# EasyEDA Pro project Příloha E.epro

# Schematic dps
Board Name: Převodník v1_1; Create Date: 2024-11-07; Page Name: Převodník; Project Name: PRO_MAT_IBIS; Schematic Name: MAT_IBIS_1; Update Date: 2024-11-07; Add into BOM: yes; Company: Your Company; Convert to PCB: yes; Date: 2024-06-18; Draw By: Diskoteka STAR; REV: 1.0; Sheet: 1/1
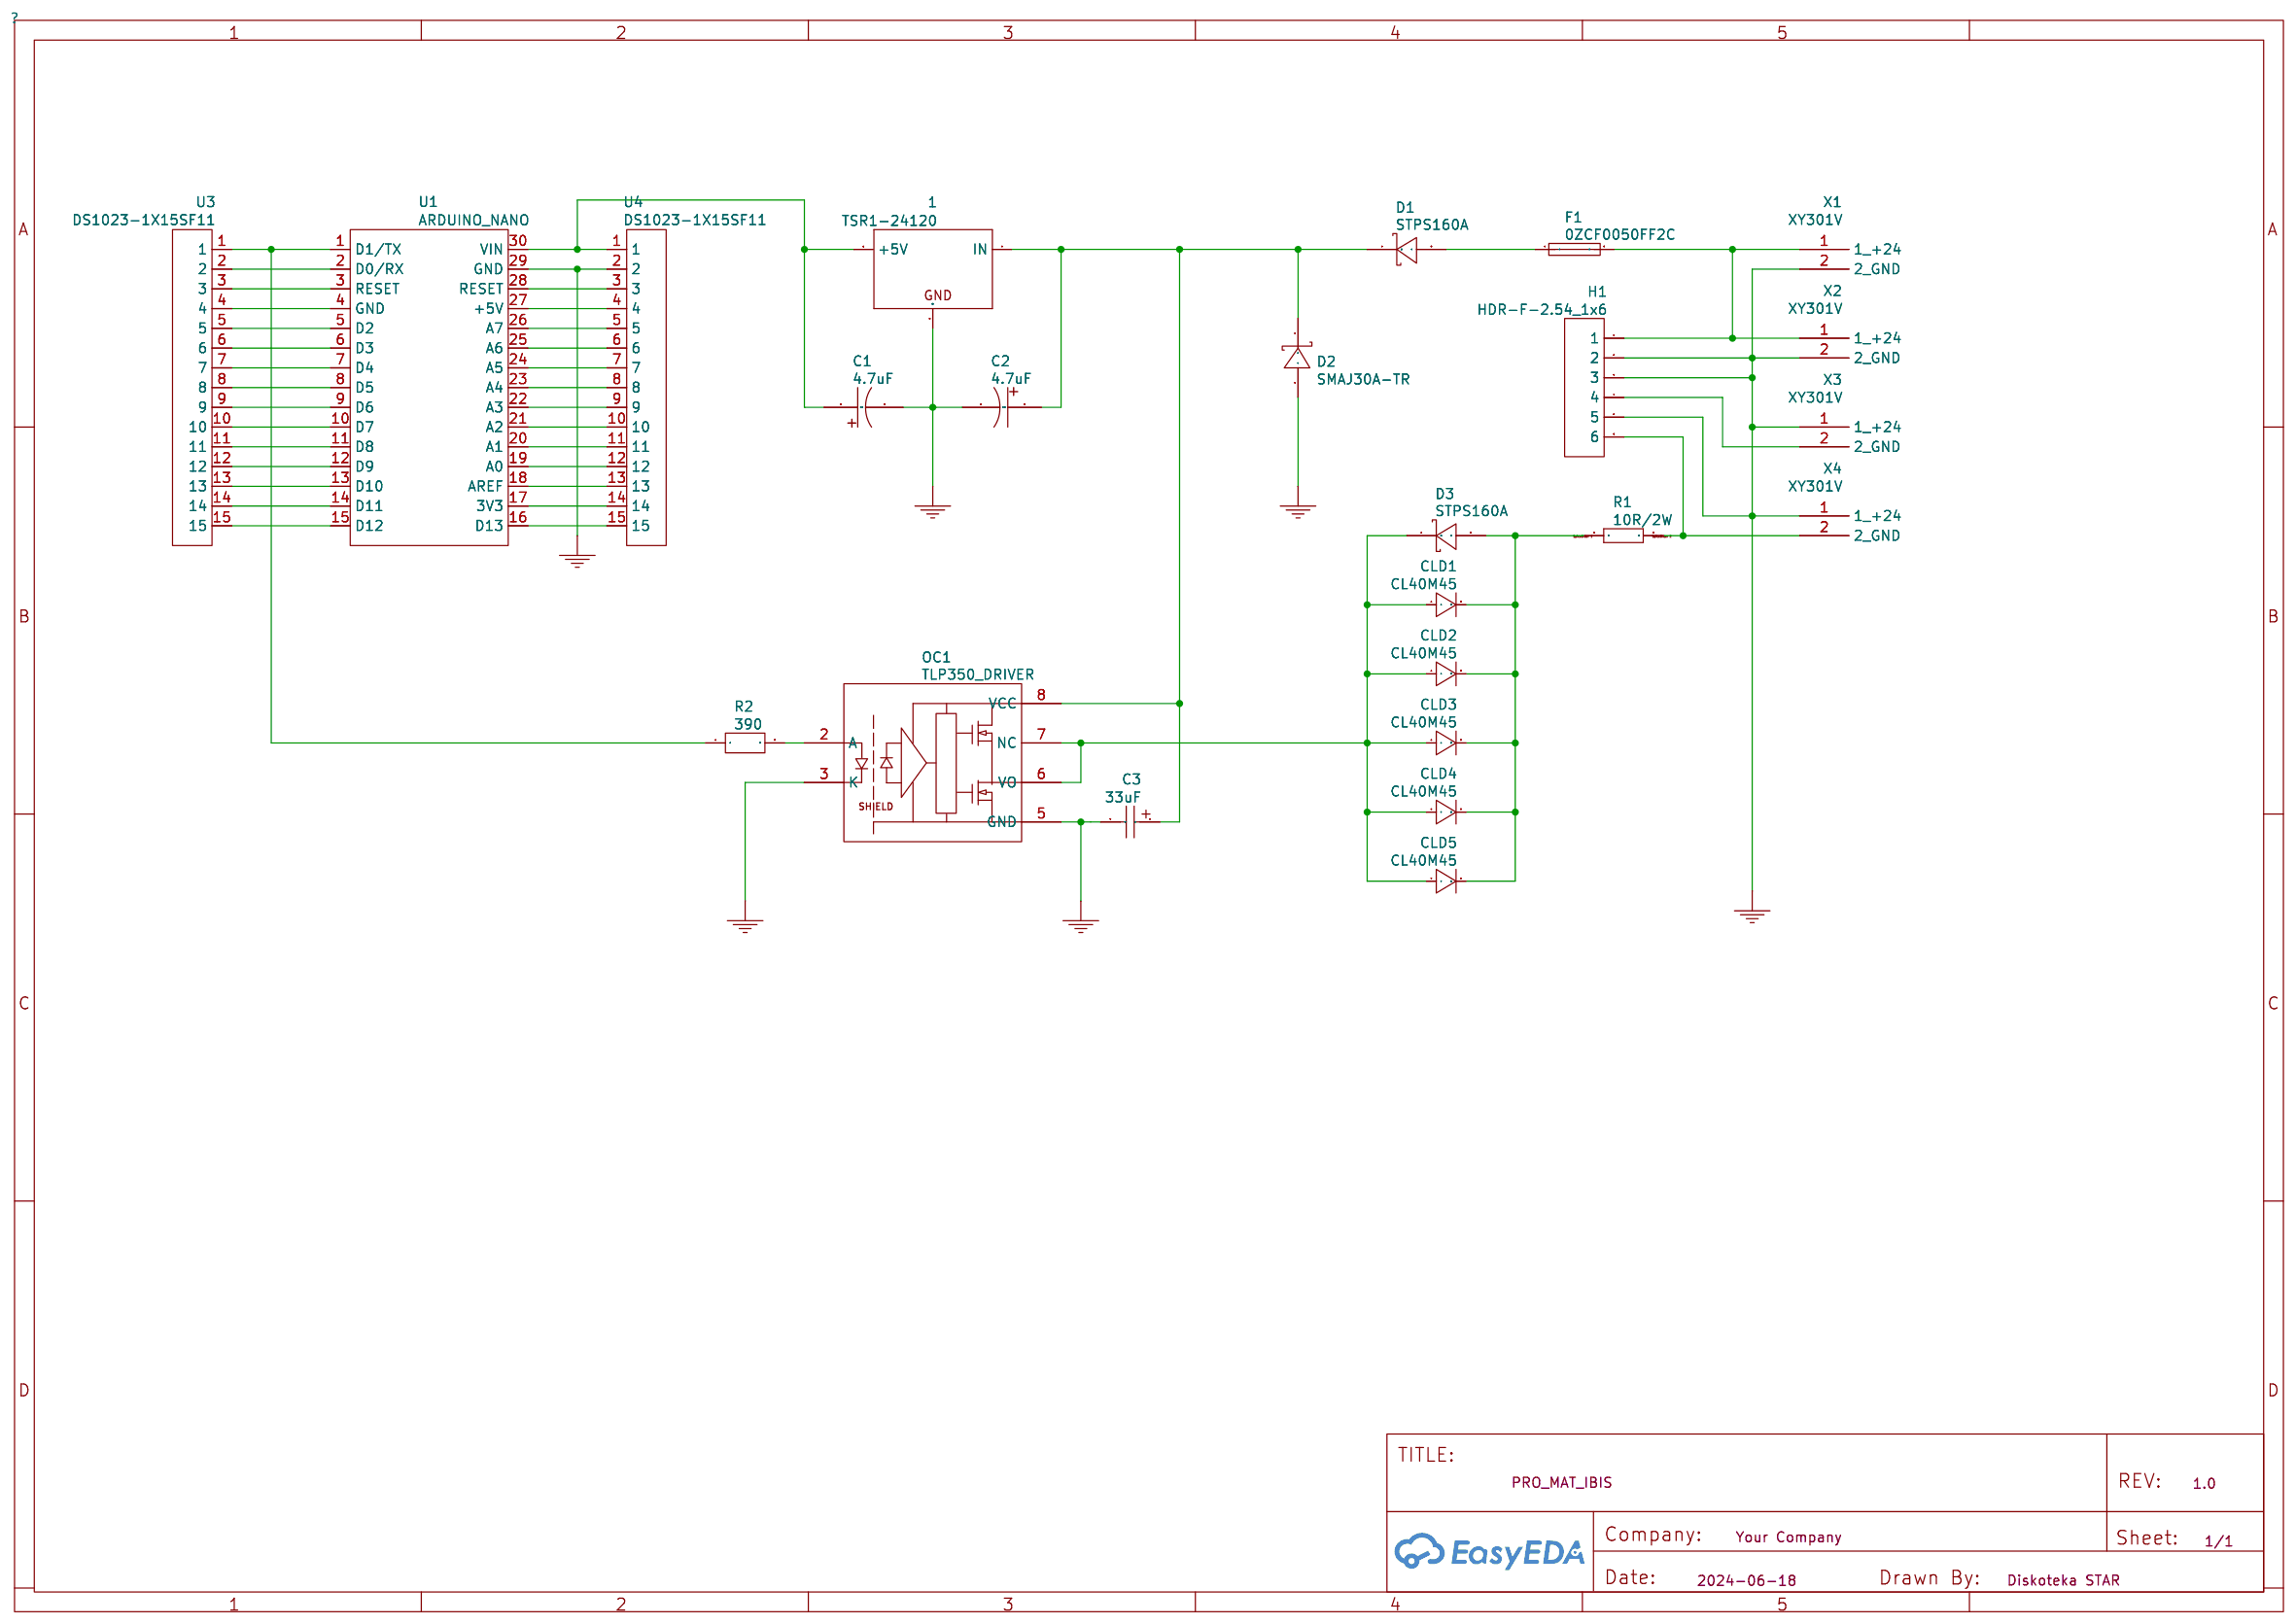
[diagram p0: schematic sheet]

## Parts
1  TSR1-24120
C1  4.7uF
C2  4.7uF
C3  33uF
CLD1  CL40M45
CLD2  CL40M45
CLD3  CL40M45
CLD4  CL40M45
CLD5  CL40M45
D1  STPS160A
D2  SMAJ30A-TR
D3  STPS160A
F1  0ZCF0050FF2C
H1  HDR-F-2.54_1x6
OC1  TLP350_DRIVER
R1  10R/2W
R2  390
U1  ARDUINO_NANO
U3  DS1023-1X15SF11
U4  DS1023-1X15SF11
X1  XY301V
X2  XY301V
X3  XY301V
X4  XY301V

## Library data of the parts
1 = TSR1-24120: Supplier: Mouser
C1 C2 = 4.7uF: Supplier: LCSC; Supplier Part: C3020635; Manufacturer: VISHAY(威世); Manufacturer Part: 293D475X9035B2TE3; JLCPCB Part Class: Extended Part
C3 = 33uF: Supplier: LCSC; Manufacturer: Kyocera AVX; Manufacturer Part: TPSD336K035R0300; Supplier Part: C8029; JLCPCB Part Class: Extended Part
CLD1-CLD5 = CL40M45: Supplier: TME; Manufacturer: DIO; Manufacturer Part: LL4148-GS08; Supplier Part: LL4148-GS08
D1 D3 = STPS160A: Supplier Part: C165938; Supplier: LCSC; Manufacturer: ST(意法半导体); JLCPCB Part Class: Extended Part
D2 = SMAJ30A-TR: Supplier: LCSC; Manufacturer: ST(意法半导体); Supplier Part: C132943; JLCPCB Part Class: Extended Part
F1 = 0ZCF0050FF2C: Supplier: Mouser; Manufacturer: Bel Fuse; Manufacturer Part: 530-0ZCF0050FF2C; Hold Current: 500 mA; Maximum Voltage: 60 VDC
H1 = HDR-F-2.54_1x6: Supplier Part: C40877; Supplier: LCSC
OC1 = TLP350_DRIVER: Supplier: LCSC; Manufacturer: TOSHIBA(东芝); Manufacturer Part: TLP350(F); Supplier Part: C50232; JLCPCB Part Class: Extended Part
R1 = 10R/2W
R2 = 390
U1 = ARDUINO_NANO: Supplier: LCSC; Supplier Part: C9900017879; Manufacturer: null; JLCPCB Part Class: Extended Part
U3 U4 = DS1023-1X15SF11: Supplier: LCSC; Supplier Part: C7509525; Manufacturer: CONNFLY; Manufacturer Part: DS1023-1x15SF11; JLCPCB Part Class: Extended Part
X1-X4 = XY301V: Supplier: LCSC; Supplier Part: C557651; Manufacturer: XINLAIYA(新莱亚); Manufacturer Part: XY301V-A-5.0-2P; JLCPCB Part Class: Extended Part

## Nets
GND: 1.2(GND) C1.2 C2.2 C3.2 D2.2(A) H1.2 H1.3 H1.5 OC1.3(K) OC1.5(GND) U1.29(GND) U4.2 X1.2(2 GND) X2.2(4 GND) X3.1(5 ME) X4.1(7 MS)
D1_2: D1.2(A) F1.1
D3_1: CLD1.1(A) CLD2.1(A) CLD3.1(A) CLD4.1(A) CLD5.1(A) D3.1(C) OC1.6(VO) OC1.7(NC)
D3_2: CLD1.2(C) CLD2.2(C) CLD3.2(C) CLD4.2(C) CLD5.2(C) D3.2(A) R1.1
F1_2: F1.2 H1.1 X1.1(1 +24) X2.1(3 +24)
Net-(1-1): 1.1(IN) C2.1 C3.1 D1.1(C) D2.1(K) OC1.8(VCC)
Net-(1-3): 1.3(+5V) C1.1 U1.30(VIN) U4.1
OC1_2: OC1.2(A) R2.2
R1_2: H1.6 R1.2 X4.2(8 SD)
U1_1: R2.1 U1.1(D1/TX) U3.1
U1_2: U1.2(D0/RX) U3.2
U1_3: U1.3(RESET) U3.3
U1_4: U1.4(GND) U3.4
U1_5: U1.5(D2) U3.5
U1_6: U1.6(D3) U3.6
U1_7: U1.7(D4) U3.7
U1_8: U1.8(D5) U3.8
U1_9: U1.9(D6) U3.9
U1_10: U1.10(D7) U3.10
U1_11: U1.11(D8) U3.11
U1_12: U1.12(D9) U3.12
U1_13: U1.13(D10) U3.13
U1_14: U1.14(D11) U3.14
U1_15: U1.15(D12) U3.15
U1_16: U1.16(D13) U4.15
U1_17: U1.17(3V3) U4.14
U1_18: U1.18(AREF) U4.13
U1_19: U1.19(A0) U4.12
U1_20: U1.20(A1) U4.11
U1_21: U1.21(A2) U4.10
U1_22: U1.22(A3) U4.9
U1_23: U1.23(A4) U4.8
U1_24: U1.24(A5) U4.7
U1_25: U1.25(A6) U4.6
U1_26: U1.26(A7) U4.5
U1_27: U1.27(+5V) U4.4
U1_28: U1.28(RESET) U4.3
X3_2: H1.4 X3.2(6 ED)

# Board dps
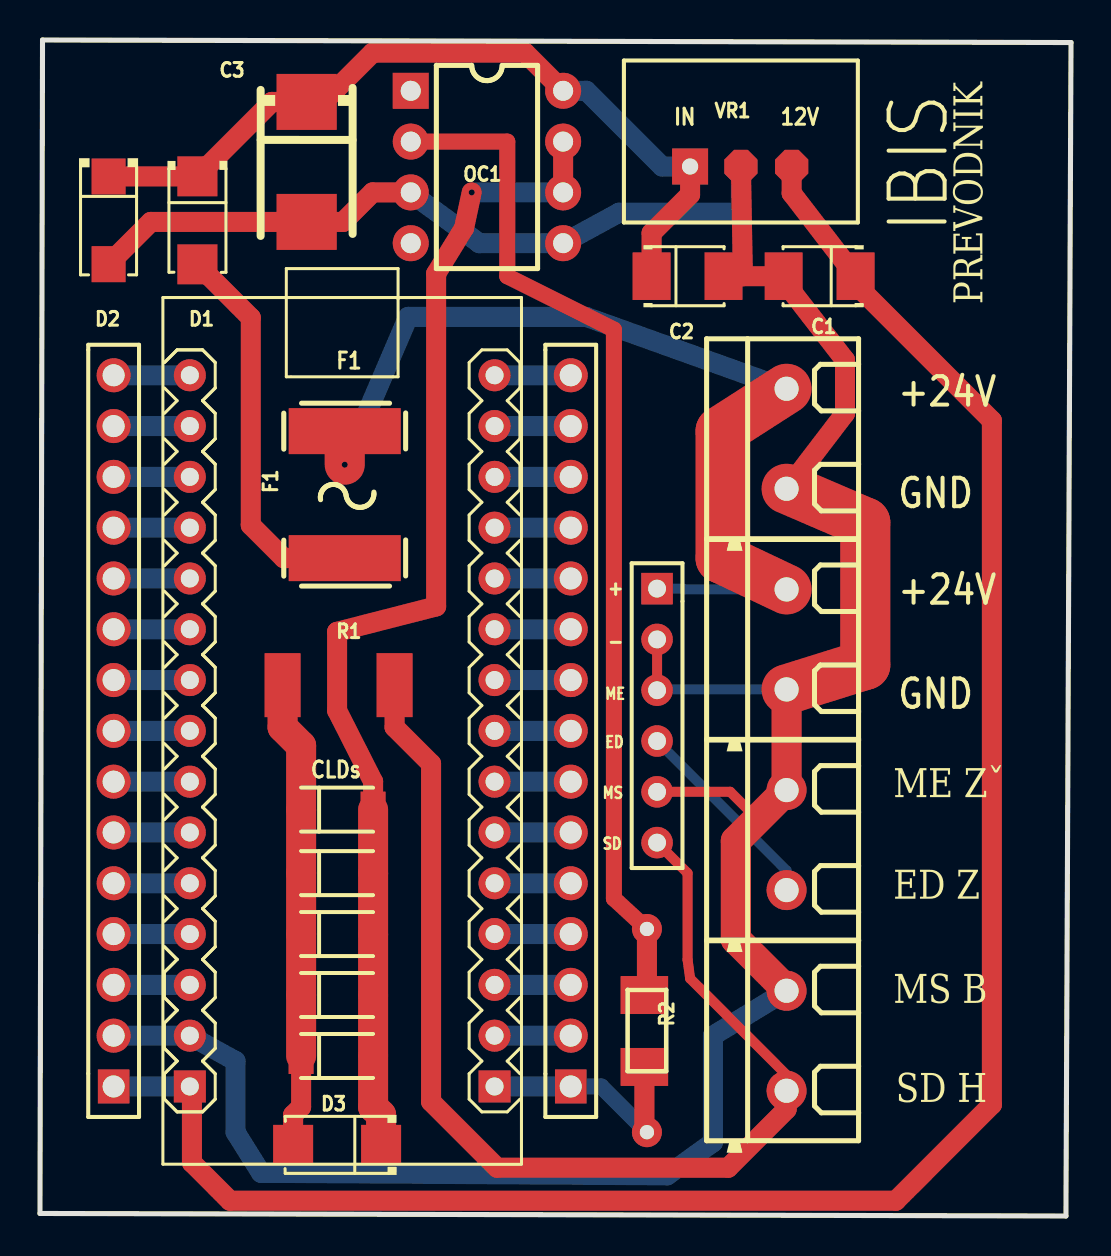
[diagram p1: board, top side]
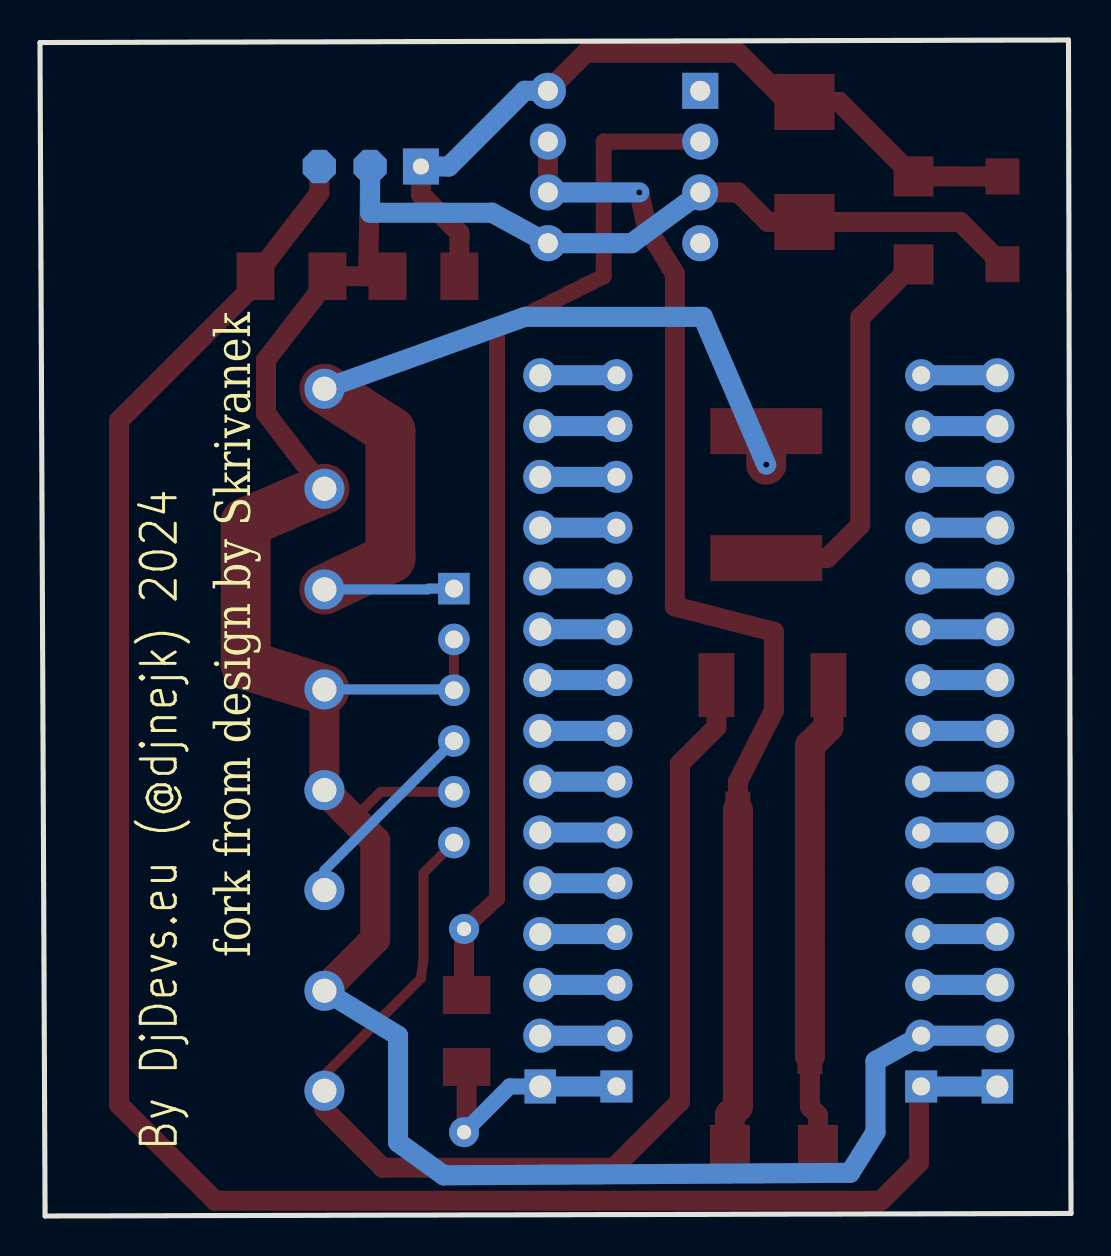
[diagram p2: board, bottom side, seen from below]

Outline 51.56 x 58.8 mm; copper layers: Top Layer, Bottom Layer. Coordinates in mm from the lower left corner of the outline.
Outline path: 0,0.13 0.13,58.8 51.56,58.67 51.31,0 0,0.13
Stack: Top Layer 0.035mm / Dielectric1 1.51mm FR4 er 4.5 / Bottom Layer 0.035mm

## Design rules (mm)
spacing Default (default): track to track 0.152, other pairs 0 to 0.152
track width Default (default): min 0.5, default 0.5, max 25.4
differential pair differentialPair (default): width min 0.127, default 0.254, max 2.54; gap min 0.152, default 0.152
via Default (default): diameter min 0.61, default 0.61, max 100.025; hole min 0.305, default 0.305, max 59.995

## Placement (name value [footprint] x y rotation side)
C1  4.7uF  [CAP-SMD_L3.5-W2.8-FD]  38.99 46.99 180 top
C2  4.7uF  [CAP-SMD_L3.5-W2.8-FD]  32.38 46.99 0 top
C3  33uF  [CASE-D_7343]  13.34 52.7 90 top
CLD1  CL40M45  [LL-34]  14.86 20.32 0 top
CLD2  CL40M45  [LL-34]  14.86 17.14 0 top
CLD3  CL40M45  [LL-34]  14.86 14.1 0 top
CLD4  CL40M45  [LL-34]  14.86 11.05 0 top
CLD5  CL40M45  [LL-34]  14.86 8 0 top
D1  STPS160A  [SMA_L4.3-W2.6-LS5.2-RD]  7.87 49.78 270 top
D2  SMAJ30A-TR  [SMA_L4.4-W2.6-LS5.0-RD]  3.43 49.78 270 top
D3  STPS160A  [SMA_L4.3-W2.6-LS5.2-RD]  14.86 3.56 180 top
F1  0ZCF0050FF2C  [F2920]  15.24 36.07 90 top
H1  HDR-F-2.54_1x6  [HDR-F-2.54_1X6]  30.86 26.29 270 top
NOREF  -  [Pad_e124]  30.23 11.05 90 top
NOREF#2  -  [Pad_e123]  30.23 7.45 90 top
OC1  TLP350_DRIVER  [DIP-8_L9.7-W6.4-P2.54-LS7.6-BL-1]  22.35 52.45 270 top
R1  10R/2W  [R2512]  14.73 26.54 0 top
R2  390  [REZISTOR]  30.23 9.4 270 top
U1  ARDUINO_NANO  [COMM-TH_ARDUINO_NANO]  15.11 24.26 270 top
U3  DS1023-1X15SF11  [HDR-TH_15P-P2.54-V-F]  26.54 24.26 90 top
U4  DS1023-1X15SF11  [HDR-TH_15P-P2.54-V-F]  3.68 24.26 90 top
VR1  TSR1-24120  [TSR-1]  35.05 53.97 0 top
X1  XY301V  [CONN-TH_XY301V-A-5.0-2P]  37.34 38.86 270 top
X2  XY301V  [CONN-TH_XY301V-A-5.0-2P]  37.34 28.83 270 top
X3  XY301V  [CONN-TH_XY301V-A-5.0-2P]  37.34 18.8 270 top
X4  XY301V  [CONN-TH_XY301V-A-5.0-2P]  37.34 8.76 270 top

## Footprints (pads in the part's own frame, mm; a bottom-side part is the same pattern mirrored in y, then rotated)
CAP-SMD_L3.5-W2.8-FD
  rect 1.9x2.376 smd: 1(-1.798,0) 2(1.798,0)
CASE-D_7343
  rect 2.799x3.01 smd: 1(3,0) 2(-3,0)
COMM-TH_ARDUINO_NANO
  rect 1.6x1.6 hole 0.9: 1(17.78,7.62) 30(17.78,-7.62)
  round 1.6 hole 0.9: 2(15.24,7.62) 3(12.7,7.62) 4(10.16,7.62) 5(7.62,7.62) 6(5.08,7.62) 7(2.54,7.62) 8(0,7.62) 9(-2.54,7.62) 10(-5.08,7.62) 11(-7.62,7.62) 12(-10.16,7.62) 13(-12.7,7.62) 14(-15.24,7.62) 15(-17.78,7.62) 16(-17.78,-7.62) 17(-15.24,-7.62) 18(-12.7,-7.62) 19(-10.16,-7.62) 20(-7.62,-7.62) 21(-5.08,-7.62) 22(-2.54,-7.62) 23(0,-7.62) 24(2.54,-7.62) 25(5.08,-7.62) 26(7.62,-7.62) 27(10.16,-7.62) 28(12.7,-7.62) 29(15.24,-7.62)
CONN-TH_XY301V-A-5.0-2P
  round 2 hole 1.205x1.2: 1(-2.5,0) 2(2.5,0)
DIP-8_L9.7-W6.4-P2.54-LS7.6-BL-1
  rect 1.8x1.8 hole 1: 1(-3.81,-3.81)
  round 1.8 hole 1: 2(-1.27,-3.81) 3(1.27,-3.81) 4(3.81,-3.81) 5(3.81,3.81) 6(1.27,3.81) 7(-1.27,3.81) 8(-3.81,3.81)
F2920
  rect 2.3x5.6 smd: 1(-3.175,0) 2(3.175,0)
HDR-F-2.54_1X6
  rect 1.575x1.575 hole 0.889: 1(-5.08,0)
  round 1.575 hole 0.889: 2(-2.54,0) 3(0,0) 4(2.54,0) 5(5.08,0) 6(7.62,0)
HDR-TH_15P-P2.54-V-F
  rect 1.7x1.575 hole 1.1: 1(-17.78,0)
  round 1.7 hole 1.1: 2(-15.24,0) 3(-12.7,0) 4(-10.16,0) 5(-7.62,0) 6(-5.08,0) 7(-2.54,0) 8(0,0) 9(2.54,0) 10(5.08,0) 11(7.62,0) 12(10.16,0) 13(12.7,0) 14(15.24,0) 15(17.78,0)
LL-34
  rect 1.25x1.8 smd: 1(1.8,0) 2(-1.8,0)
Pad_e123
  rect 1.9x2.376 smd: 1(0,0)
Pad_e124
  rect 1.9x2.376 smd: 2(0,0)
R2512
  rect 1.8x3.2 smd: 1(-2.6,0) 2(3,0)
REZISTOR
  round 1.5 hole 0.711: 1(5.207,0.128) 2(-4.954,0.128)
SMA_L4.3-W2.6-LS5.2-RD
  rect 2x2 smd: 1(-2.2,0) 2(2.2,0)
SMA_L4.4-W2.6-LS5.0-RD
  rect 1.8x1.7 smd: 1(-2.192,0) 2(2.192,0)
TSR-1
  rect 1.8x1.8 hole 0.805x0.8: 1(-2.54,-1.5)
  custom 1.663x1.663 hole 0.805x0.8: 2(0,-1.5) 3(2.54,-1.5)

## Nets
As in the schematic, except:
GND: C1.2 C2.2 C3.2 D2.2 H1.2 H1.3 H1.5 OC1.3 OC1.5 U1.29 U4.2 VR1.2 X1.2 X2.2 X3.1 X4.1
1_1: C2.1 C3.1 D1.1 D2.1 OC1.8 VR1.1
OC1_2: NOREF.2 OC1.2 R2.2
U1_1: NOREF#2.1 R2.1 U1.1 U3.1
U1_30: C1.1 U1.30 U4.1 VR1.3

Pads without a net: OC1 1 4

## Via types
v1: diameter 0.61, hole 0.305, Top Layer to Bottom Layer, 2 vias

## Routing (per net, layer and track width the routed paths; a pad name or vN(x,y) marks a point on that pad's centre or on a via; arc(x,y) is an arc through that point)
GND: length 154.8
  Top Layer w0.5: X3.1 35.89,19.84 34.52,21.21 H1.5 ; H1.2 H1.3 ; VR1.2 35.05,51.14 ; C1.2 37.23,46.99
  Top Layer w1: 35.05,52.58 35.15,46.99 34.18,47.09 ; OC1.3 16.64,51.18 15.16,49.7 C3.2 5.54,49.7 D2.2 ; X1.2 37.38,36.36 40.26,40.13 40.26,42.8 37.19,46.76 C1.2 C2.2
  Top Layer w1.5: X2.2 X3.1 34.8,18.76 34.8,13.84 37.34,11.3 X4.1
  Top Layer w2.5: X1.2 41.28,34.67 41.28,27.56 X2.2
  Bottom Layer w0.5: H1.3 30.9,26.33 X2.2
  Bottom Layer w1: U4.2 U1.29 9.78,7.75 9.78,4.19 11.05,2.16 31.37,2.03 33.66,3.68 33.66,9.02 X4.1 ; OC1.3 18.54,51.15 21.97,48.64 OC1.5 28.96,50.17 35.05,50.17 VR1.2
1_1: length 40.3
  Top Layer w1: D1.1 11.59,55.7 C3.1 14.18,55.7 16.64,58.17 24.26,58.17 OC1.8 ; C2.1 30.59,49.15 32.51,51.07 VR1.1 ; D2.1 7.87,51.98
  Bottom Layer w1: OC1.8 27.33,56.26 31.11,52.47 VR1.1
D1_2: length 22.8
  Top Layer w0.5: F1.1 11.94,32.89
  Top Layer w1: F1.1 12.19,32.89 10.54,34.54 10.54,44.92 D1.2
D3_1: length 59.6
  Top Layer w1: OC1.6 OC1.7 ; 16.66,21.72 14.86,25.27 14.86,29.21 19.81,30.48 19.81,47.12 21.21,49.4 v1(21.59,51.18) ; CLD1.1 16.66,21.72
  Top Layer w1.5: D3.1 17.06,5.06 16.66,5.46 CLD5.1 CLD4.1 CLD3.1 CLD2.1 CLD1.1
  Bottom Layer w1: OC1.6 v1(21.59,51.18)
D3_2: length 23.5
  Top Layer w1: D3.2 12.66,5.06 13.06,5.46 CLD5.2
  Top Layer w1.5: CLD5.2 CLD4.2 CLD3.2 CLD2.2 CLD1.2 13.06,23.52 12.13,24.44 R1.1
F1_2: length 49.7
  Top Layer w2: F1.2 v1(15.24,37.57)
  Top Layer w2.5: X1.1 34.04,39.24 34.04,32.89 X2.1
  Bottom Layer w0.5: X2.1 32.19,31.33 32.15,31.37 H1.1
  Bottom Layer w1: 15.24,37.57 18.41,44.96 27.31,44.96 X1.1
OC1_2: length 51.6
  Top Layer w0.8: OC1.2 23.37,53.72 23.37,46.99 28.7,44.32 28.7,15.88 R2.2
  Top Layer w1: NOREF.2 30.35,11.18 R2.2
R1_2: length 57.9
  Top Layer w0.5: H1.6 32.38,17.14 32.38,12.83 32.51,11.87 37.34,7.05 X4.2
  Top Layer w1: 17.73,24.44 19.56,22.62 19.56,5.72 22.86,2.41 34.42,2.41 37.34,5.33 X4.2 ; R1.2 17.73,24.44
U1_1: length 11.9
  Top Layer w1: R2.1 30.23,4.32 NOREF#2.1
  Bottom Layer w0.8: R2.1 28.07,6.48 U3.1
  Bottom Layer w1: U1.1 U3.1
U1_2: length 3.8
  Bottom Layer w1: U3.2 U1.2
U1_3: length 3.8
  Bottom Layer w1: U3.3 U1.3
U1_4: length 3.8
  Bottom Layer w1: U3.4 U1.4
U1_5: length 3.8
  Bottom Layer w1: U3.5 U1.5
U1_6: length 3.8
  Bottom Layer w1: U3.6 U1.6
U1_7: length 3.8
  Bottom Layer w1: U3.7 U1.7
U1_8: length 3.8
  Bottom Layer w1: U3.8 U1.8
U1_9: length 3.8
  Bottom Layer w1: U3.9 U1.9
U1_10: length 3.8
  Bottom Layer w1: U3.10 U1.10
U1_11: length 3.8
  Bottom Layer w1: U3.11 U1.11
U1_12: length 3.8
  Bottom Layer w1: U3.12 U1.12
U1_13: length 3.8
  Bottom Layer w1: U3.13 U1.13
U1_14: length 3.8
  Bottom Layer w1: U3.14 U1.14
U1_15: length 3.8
  Bottom Layer w1: U3.15 U1.15
U1_16: length 3.8
  Bottom Layer w1: U4.15 U1.16
U1_17: length 3.8
  Bottom Layer w1: U4.14 U1.17
U1_18: length 3.8
  Bottom Layer w1: U4.13 U1.18
U1_19: length 3.8
  Bottom Layer w1: U4.12 U1.19
U1_20: length 3.8
  Bottom Layer w1: U4.11 U1.20
U1_21: length 3.8
  Bottom Layer w1: U4.10 U1.21
U1_22: length 3.8
  Bottom Layer w1: U4.9 U1.22
U1_23: length 3.8
  Bottom Layer w1: U4.8 U1.23
U1_24: length 3.8
  Bottom Layer w1: U4.7 U1.24
U1_25: length 3.8
  Bottom Layer w1: U4.6 U1.25
U1_26: length 3.8
  Bottom Layer w1: U4.5 U1.26
U1_27: length 3.8
  Bottom Layer w1: U4.4 U1.27
U1_28: length 3.8
  Bottom Layer w1: U4.3 U1.28
U1_30: length 101
  Top Layer w0.5: 40.79,47.83 C1.1
  Top Layer w1: C1.1 37.59,51.14 VR1.3 ; 7.6,5.97 7.6,2.67 9.5,0.76 42.8,0.76 47.6,5.57 47.6,39.77 40.89,46.48
  Bottom Layer w1: U4.1 U1.30
X3_2: length 10.1
  Bottom Layer w0.5: H1.4 37.34,17.27 X3.2

## Text on the board
Bottom Silkscreen Layer: By DjDevs.eu (@djnejk) 2024 | fork from design by Skrivanek
Top Silkscreen Layer: MS | SD | ME | ED | + | - | CLDs | F1 | IN | 12V | +24V | GND | IBIS | ME Zˇ | ED Z | MS B | SD H | PREVODNIK
